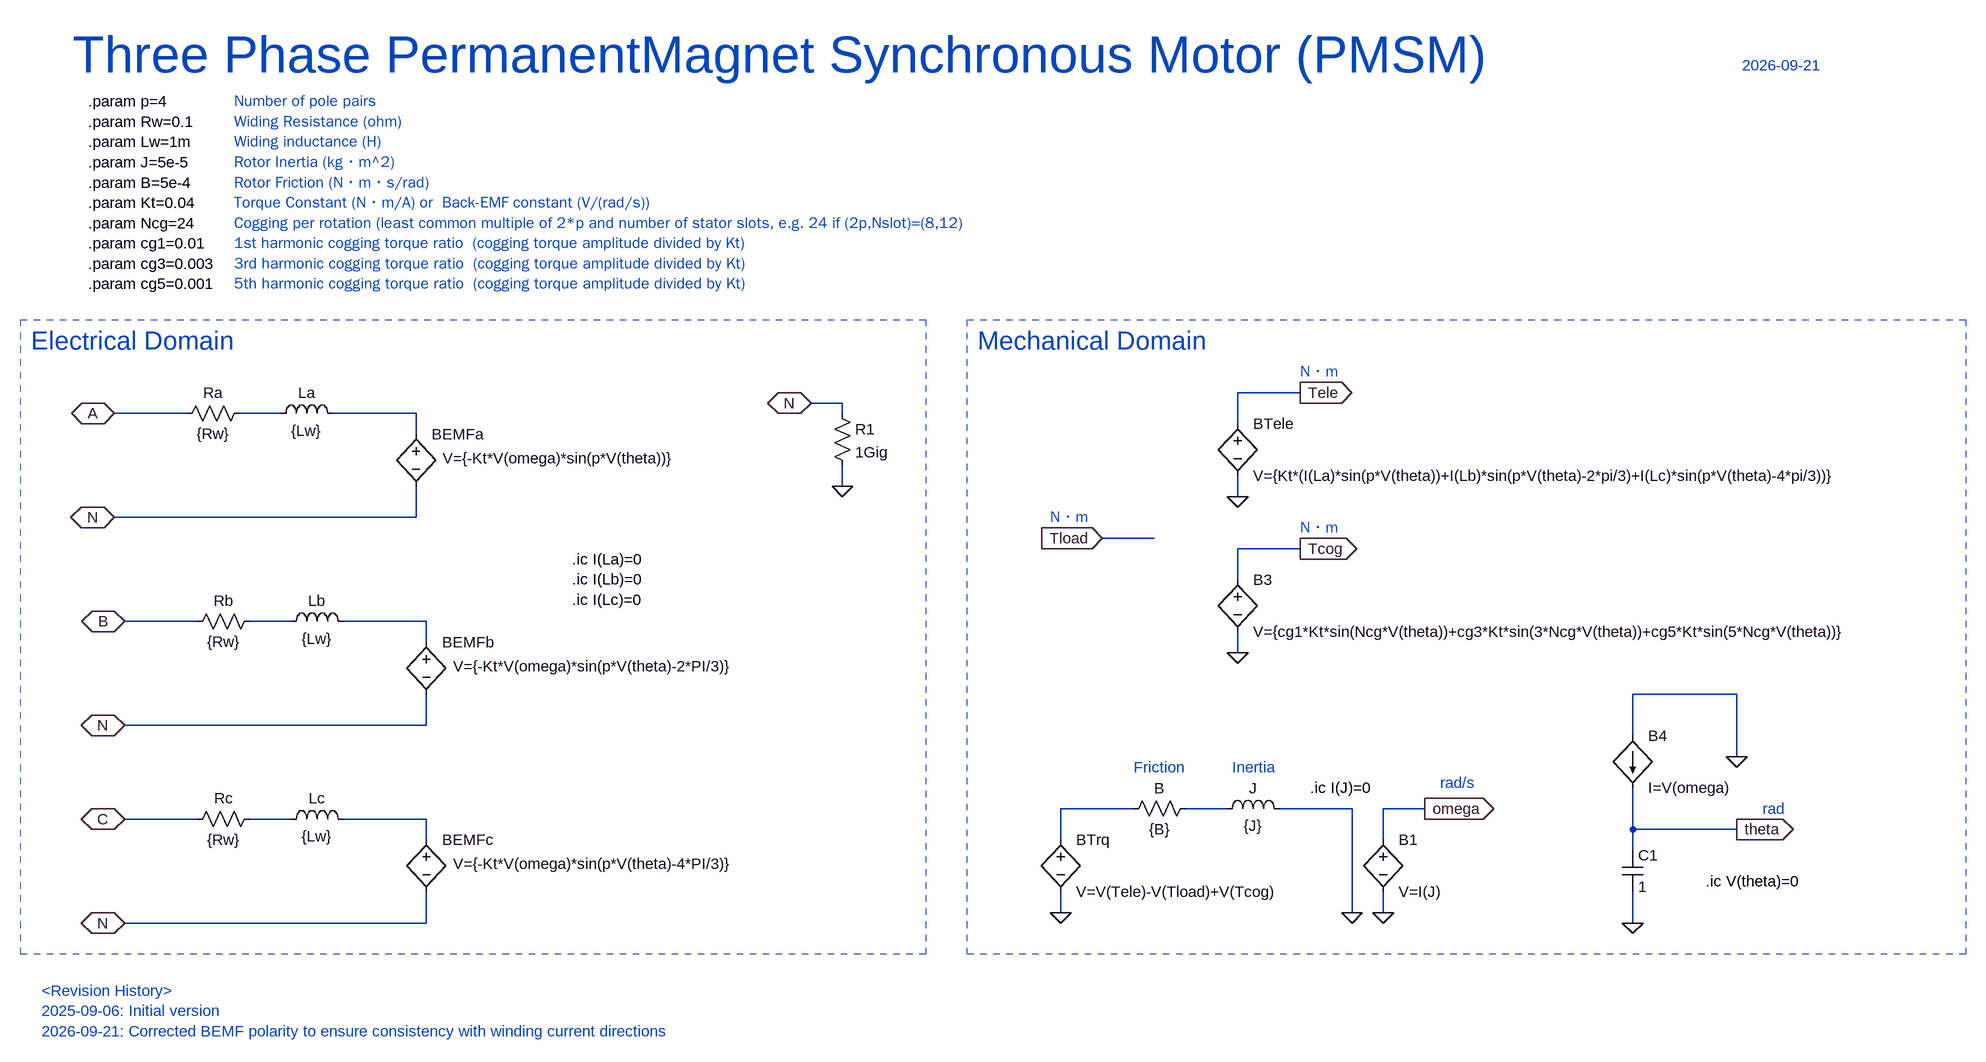
[diagram p0: schematic PMSM.asc]
PMSM.asc, the LTspice schematic file:
Version 4.1
SHEET 1 2928 2296
WIRE 1760 560 1664 560
WIRE 1056 576 1008 576
WIRE 48 592 -64 592
WIRE 192 592 128 592
WIRE 400 592 272 592
WIRE 1056 592 1056 576
WIRE 1664 608 1664 560
WIRE 400 624 400 592
WIRE 1056 704 1056 672
WIRE 1664 720 1664 688
WIRE 400 752 400 704
WIRE 400 752 -64 752
WIRE 1536 784 1456 784
WIRE 1760 800 1664 800
WIRE 1664 848 1664 800
WIRE 64 912 -48 912
WIRE 208 912 144 912
WIRE 416 912 288 912
WIRE 416 944 416 912
WIRE 1664 960 1664 928
WIRE 2432 1024 2272 1024
WIRE 416 1072 416 1024
WIRE 416 1072 -48 1072
WIRE 2272 1088 2272 1024
WIRE 2432 1120 2432 1024
WIRE 1504 1200 1392 1200
WIRE 1648 1200 1584 1200
WIRE 1840 1200 1728 1200
WIRE 1952 1200 1888 1200
WIRE 64 1216 -48 1216
WIRE 208 1216 144 1216
WIRE 416 1216 288 1216
WIRE 2272 1232 2272 1168
WIRE 2432 1232 2272 1232
WIRE 416 1248 416 1216
WIRE 1392 1248 1392 1200
WIRE 1888 1248 1888 1200
WIRE 2272 1264 2272 1232
WIRE 1392 1360 1392 1328
WIRE 1840 1360 1840 1200
WIRE 1888 1360 1888 1328
WIRE 416 1376 416 1328
WIRE 416 1376 -48 1376
WIRE 2272 1376 2272 1328
FLAG 1664 960 0
FLAG 1392 1360 0
FLAG 2272 1376 0
FLAG 1456 784 Tload
IOPIN 1456 784 In
FLAG -64 592 A
IOPIN -64 592 BiDir
FLAG -48 912 B
IOPIN -48 912 BiDir
FLAG 2432 1232 theta
IOPIN 2432 1232 Out
FLAG 1952 1200 omega
IOPIN 1952 1200 Out
FLAG 1760 800 Tcog
IOPIN 1760 800 Out
FLAG 1840 1360 0
FLAG 2432 1120 0
FLAG 1664 720 0
FLAG 1760 560 Tele
IOPIN 1760 560 Out
FLAG -64 752 N
IOPIN -64 752 BiDir
FLAG -48 1072 N
IOPIN -48 1072 BiDir
FLAG -48 1216 C
IOPIN -48 1216 BiDir
FLAG -48 1376 N
IOPIN -48 1376 BiDir
FLAG 1008 576 N
IOPIN 1008 576 BiDir
FLAG 1056 704 0
FLAG 1888 1360 0
SYMBOL res 144 576 R90
WINDOW 0 0 56 VBottom 2
WINDOW 3 32 56 VTop 2
SYMATTR InstName Ra
SYMATTR Value {Rw}
SYMBOL ind 288 608 M270
WINDOW 0 32 56 VTop 2
WINDOW 3 5 56 VBottom 2
SYMATTR InstName La
SYMATTR Value {Lw}
SYMBOL res 160 896 R90
WINDOW 0 0 56 VBottom 2
WINDOW 3 32 56 VTop 2
SYMATTR InstName Rb
SYMATTR Value {Rw}
SYMBOL ind 304 928 M270
WINDOW 0 32 56 VTop 2
WINDOW 3 5 56 VBottom 2
SYMATTR InstName Lb
SYMATTR Value {Lw}
SYMBOL bv 416 928 R0
WINDOW 3 41 53 Left 2
SYMATTR Value V={-Kt*V(omega)*sin(p*V(theta)-2*PI/3)}
SYMATTR InstName BEMFb
SYMBOL bv 1664 832 R0
SYMATTR InstName B3
SYMATTR Value V={cg1*Kt*sin(Ncg*V(theta))+cg3*Kt*sin(3*Ncg*V(theta))+cg5*Kt*sin(5*Ncg*V(theta))}
SYMBOL ind 1632 1216 R270
WINDOW 0 32 56 VTop 2
WINDOW 3 5 56 VBottom 2
SYMATTR InstName J
SYMATTR Value {J}
SYMBOL bv 1392 1232 R0
SYMATTR InstName BTrq
SYMATTR Value V=V(Tele)-V(Tload)+V(Tcog)
SYMBOL cap 2256 1264 R0
SYMATTR InstName C1
SYMATTR Value 1
SYMBOL res 1600 1184 R90
WINDOW 0 0 56 VBottom 2
WINDOW 3 32 56 VTop 2
SYMATTR InstName B
SYMATTR Value {B}
SYMBOL bi 2272 1088 R0
SYMATTR InstName B4
SYMATTR Value I=V(omega)
SYMBOL bv 400 608 R0
WINDOW 3 41 53 Left 2
SYMATTR Value V={-Kt*V(omega)*sin(p*V(theta))}
SYMATTR InstName BEMFa
SYMBOL bv 1664 592 R0
SYMATTR InstName BTele
SYMATTR Value V={Kt*(I(La)*sin(p*V(theta))+I(Lb)*sin(p*V(theta)-2*pi/3)+I(Lc)*sin(p*V(theta)-4*pi/3))}
SYMBOL res 160 1200 R90
WINDOW 0 0 56 VBottom 2
WINDOW 3 32 56 VTop 2
SYMATTR InstName Rc
SYMATTR Value {Rw}
SYMBOL ind 304 1232 M270
WINDOW 0 32 56 VTop 2
WINDOW 3 5 56 VBottom 2
SYMATTR InstName Lc
SYMATTR Value {Lw}
SYMBOL bv 416 1232 R0
WINDOW 3 41 53 Left 2
SYMATTR Value V={-Kt*V(omega)*sin(p*V(theta)-4*PI/3)}
SYMATTR InstName BEMFc
SYMBOL res 1040 576 R0
SYMATTR InstName R1
SYMATTR Value 1Gig
SYMBOL bv 1888 1232 R0
SYMATTR InstName B1
SYMATTR Value V=I(J)
TEXT -104 112 Left 2 !.param p=4\n.param Rw=0.1\n.param Lw=1m\n.param J=5e-5\n.param B=5e-4\n.param Kt=0.04\n.param Ncg=24\n.param cg1=0.01\n.param cg3=0.003\n.param cg5=0.001
TEXT -128 40 Left 6 ;Three Phase PermanentMagnet Synchronous Motor (PMSM)
TEXT 2440 56 Left 2 ;2026-09-21
TEXT 2384 1312 Left 2 !.ic V(theta)=0
TEXT 1776 1168 Left 2 !.ic I(J)=0
TEXT 1656 1136 Left 2 ;Inertia
TEXT 1504 1136 Left 2 ;Friction
TEXT 640 816 Left 2 !.ic I(La)=0\n.ic I(Lb)=0\n.ic I(Lc)=0
TEXT 120 112 Left 2 ;Number of pole pairs\nWiding Resistance (ohm)\nWiding inductance (H)\nRotor Inertia (kg・m^2)\nRotor Friction (N・m・s/rad)\nTorque Constant (N・m/A) or  Back-EMF constant (V/(rad/s))\nCogging per rotation (least common multiple of 2*p and number of stator slots, e.g. 24 if (2p,Nslot)=(8,12)\n1st harmonic cogging torque ratio  (cogging torque amplitude divided by Kt)\n3rd harmonic cogging torque ratio  (cogging torque amplitude divided by Kt)\n5th harmonic cogging torque ratio  (cogging torque amplitude divided by Kt)
TEXT -176 1480 Left 2 ;<Revision History>\n2025-09-06: Initial version\n2026-09-21: Corrected BEMF polarity to ensure consistency with winding current directions
TEXT -192 480 Left 4 ;Electrical Domain
TEXT 1264 480 Left 4 ;Mechanical Domain
TEXT 2472 1200 Left 2 ;rad
TEXT 1976 1160 Left 2 ;rad/s
TEXT 1376 752 Left 2 ;N・m
TEXT 1760 528 Left 2 ;N・m
TEXT 1760 768 Left 2 ;N・m
RECTANGLE Normal 1184 1424 -208 448 2
RECTANGLE Normal 2784 1424 1248 448 2

The netlist it stands for:
* PMSM.asc
Ra N001 A {Rw}
La N002 N001 {Lw}
Rb N003 B {Rw}
Lb N004 N003 {Lw}
BEMFb N004 N V={-Kt*V(omega)*sin(p*V(theta)-2*PI/3)}
B3 Tcog 0 V={cg1*Kt*sin(Ncg*V(theta))+cg3*Kt*sin(3*Ncg*V(theta))+cg5*Kt*sin(5*Ncg*V(theta))}
L§J N006 0 {J}
BTrq N005 0 V=V(Tele)-V(Tload)+V(Tcog)
C1 theta 0 1
R§B N006 N005 {B}
B4 0 theta I=V(omega)
BEMFa N002 N V={-Kt*V(omega)*sin(p*V(theta))}
BTele Tele 0 V={Kt*(I(La)*sin(p*V(theta))+I(Lb)*sin(p*V(theta)-2*pi/3)+I(Lc)*sin(p*V(theta)-4*pi/3))}
Rc N007 C {Rw}
Lc N008 N007 {Lw}
BEMFc N008 N V={-Kt*V(omega)*sin(p*V(theta)-4*PI/3)}
R1 N 0 1Gig
B1 omega 0 V=I(J)
.param p=4
.param Rw=0.1
.param Lw=1m
.param J=5e-5
.param B=5e-4
.param Kt=0.04
.param Ncg=24
.param cg1=0.01
.param cg3=0.003
.param cg5=0.001
* Three Phase PermanentMagnet Synchronous Motor (PMSM)
* 2026-09-21
.ic V(theta)=0
.ic I(J)=0
* Inertia
* Friction
.ic I(La)=0
.ic I(Lb)=0
.ic I(Lc)=0
* Number of pole pairs
* Widing Resistance (ohm)
* Widing inductance (H)
* Rotor Inertia (kg・m^2)
* Rotor Friction (N・m・s/rad)
* Torque Constant (N・m/A) or  Back-EMF constant (V/(rad/s))
* Cogging per rotation (least common multiple of 2*p and number of stator slots, e.g. 24 if (2p,Nslot)=(8,12)
* 1st harmonic cogging torque ratio  (cogging torque amplitude divided by Kt)
* 3rd harmonic cogging torque ratio  (cogging torque amplitude divided by Kt)
* 5th harmonic cogging torque ratio  (cogging torque amplitude divided by Kt)
* <Revision History>
* 2025-09-06: Initial version
* 2026-09-21: Corrected BEMF polarity to ensure consistency with winding current directions
* Electrical Domain
* Mechanical Domain
* rad
* rad/s
* N・m
* N・m
* N・m
.backanno
.end